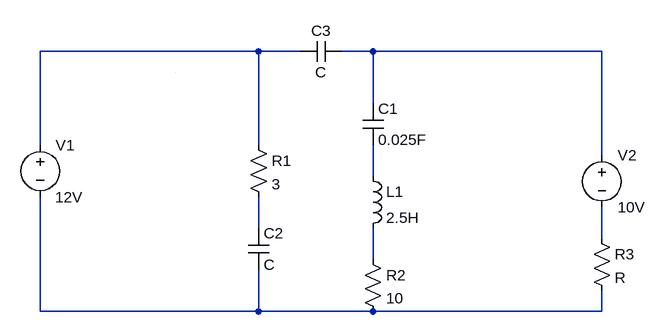
[diagram p0: schematic LtSpice.asc]
LtSpice.asc, the LTspice schematic file:
Version 4
SHEET 1 880 680
WIRE 128 -32 -208 -32
WIRE 192 -32 128 -32
WIRE 304 -32 256 -32
WIRE 656 -32 304 -32
WIRE 304 48 304 -32
WIRE -208 112 -208 -32
WIRE 128 112 128 -32
WIRE 656 128 656 -32
WIRE 304 160 304 112
WIRE 128 240 128 192
WIRE 656 256 656 208
WIRE 304 288 304 240
WIRE -208 368 -208 192
WIRE 128 368 128 304
WIRE 128 368 -208 368
WIRE 304 368 128 368
WIRE 656 368 656 336
WIRE 656 368 304 368
WIRE 0 0 0 0
SYMBOL res 112 96 R0
SYMATTR InstName R1
SYMATTR Value 3
SYMBOL voltage -208 96 R0
WINDOW 3 23 96 Left 2
SYMATTR Value 12V
SYMATTR InstName V1
SYMBOL cap 288 48 R0
SYMATTR InstName C1
SYMATTR Value 0.025F
SYMBOL ind 288 144 R0
SYMATTR InstName L1
SYMATTR Value 2.5H
SYMBOL res 288 272 R0
SYMATTR InstName R2
SYMATTR Value 10
SYMBOL voltage 656 112 R0
SYMATTR InstName V2
SYMATTR Value 10V
SYMBOL cap 112 240 R0
SYMATTR InstName C2
SYMBOL res 640 240 R0
SYMATTR InstName R3
SYMBOL cap 256 -48 R90
WINDOW 0 0 32 VBottom 2
WINDOW 3 32 32 VTop 2
SYMATTR InstName C3

The netlist it stands for:
* LtSpice.asc
R1 N001 N004 3
V1 N001 N007 12V
C1 N002 N003 0.025F
L1 N003 N006 2.5H
R2 N006 N007 10
V2 N002 N005 10V
C2 N004 N007 C
R3 N005 N007 R
C3 N002 N001 C
.backanno
.end